# Altium schematic sheet SCH.SchDoc
size A4
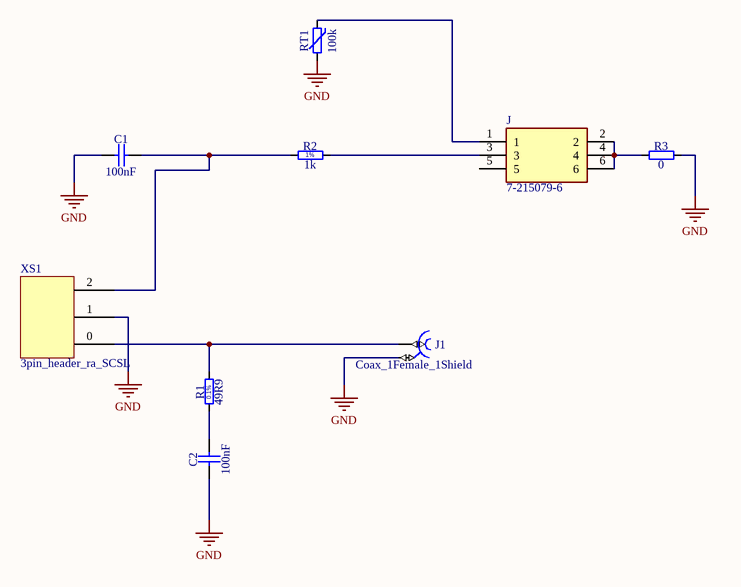
[diagram p0: SCH.SchDoc]

## Parts
C1  100nF  [CAPC2012X135N]
C2  100nF  [CAPC2012X135N]
J  7-215079-6  [TE_7-215079-6]
J1  Coax_1Female_1Shield  [HUBER-SUHNER_85_MMCX-50-0-1/111_OE]
R1  49R9  [RESC2012X60N]
R2  1k  [RESC2012X60N]
R3  0  [RESC2012X60N]
RT1  100k  [THERMC2013X95N]
XS1  3pin_header_ra_SCSL  [3pin_header_SCSL_FEMALE]

## Nets
GND: C1.1 C2.1 J1.2 R3.2 RT1.1 XS1.1
NetC1_2: C1.2 R2.1 XS1.2
NetC2_2: C2.2 R1.1
NetJ1_1: J1.1 R1.2 XS1.0
NetJ_1: J.1 RT1.2
NetJ_2: J.2 J.4 J.6 R3.1
NetJ_3: J.3 R2.2

Not connected (* = marked no-connect by the designer): J 5

## Notes on the sheet
- (in symbol R0805_1K_1%_0.33W_100PPM_VISHAY_CRCW-HP) 1%
- (in symbol R0805_49R9_0.1%_0.1W_10PPM) 0.1%

## Library data of the parts
C1 C2 = CC0805_100NF_50V_10%_X7R: Non-polarised capacitor; Part Description: SMD Multilayer Chip Ceramic Capacitor; Manufacturer: GENERIC; Manufacturer1 Part Number: C2012X7R1H104K085AA; Voltage: 50V; TC: X7R; Tolerance: ±10%; Part Number: CC0805_100NF_50V_10%_X7R; Component Kind: Standard; Component Type: Standard; Pin Count: 2; Value: 100nF; Status: Preferred; Manufacturer Part Number: CC0805_100NF_50V_10%_X7R; Case: 0805; Mounted: Yes; Socket: No; SMD: Yes; Sense: No; Manufacturer1 Example: TDK; Manufacturer1 ComponentHeight: 1mm; HelpURL: \\cern.ch\dfs\Applications\Altium\Datasheets\CC0805_X7R_TDK_C.pdf; Author: CERN DEM JLC; CreateDate: 03.12.2007; LatestRevisionDate: 22.04.2015
J = 7-215079-6: Conn FFC Connector F 6 POS 1.27mm Solder ST Thru-Hole Automotive Box/Carton; MF: TE Connectivity; Price: None; Availability: Unavailable; MP: 7-215079-6; Value: *; SnapEDA_Link: https://www.snapeda.com/parts/7-215079-6/TE%20Connectivity%20AMP%20Connectors/view-part/498770/?ref=snap; Package: None
J1 = HUBER-SUHNER_85_MMCX-50-0-1/111_OE: Part Description: MMCX 50 Ohms Right Angle PCB Jack; Manufacturer: HUBER+SUHNER; PressFit: No; Part Number: HUBER-SUHNER_85_MMCX-50-0-1/111_OE; Component Kind: Standard; Component Type: Standard; Pin Count: 2; Family: MMCX; Mounted: Yes; Socket: No; SMD: No; Sense: No; Status: None; Manufacturer Part Number: 85_MMCX-50-0-1/111_OE; ComponentHeight: 9.6mm; HelpURL: \\cern.ch\dfs\Applications\Altium\Datasheets\HUBER-SUHNER_85_MMCX-50-0-1-111_OE.pdf; Author: CERN DEM JLC; CreateDate: 06.11.2014; LatestRevisionDate: 06.11.2014
R1 = R0805_49R9_0.1%_0.1W_10PPM: Resistor - 0.1%; Part Description: Thin Film Chip Resistor; Manufacturer: GENERIC; Manufacturer1 Part Number: RN73C2A49R9BTG; Power: 0.1W; TC: ±10ppm; PressFit: No; Part Number: R0805_49R9_0.1%_0.1W_10PPM; Component Kind: Standard; Component Type: Standard; Pin Count: 2; Value: 49R9; Status: Not Recommended; Tolerance: ±0.1%; Manufacturer Part Number: R0805_49R9_0.1%_0.1W_10PPM; Case: 0805; Mounted: Yes; Sense: No; Socket: No; SMD: Yes; Manufacturer1 Example: TYCO HOLSWORTHY; Manufacturer1 ComponentHeight: 0.6mm; HelpURL: \\cern.ch\dfs\Applications\Altium\Datasheets\R0805_Tyco_RN73.pdf; Author: CERN DEM JLC; CreateDate: 03.12.2007; LatestRevisionDate: 13.03.2008
R2 = R0805_1K_1%_0.33W_100PPM_VISHAY_CRCW-HP: Resistor - 1%; Part Description: 150V, Pulse Proof, High Power Thick Film Chip Resistor; Manufacturer: VISHAY DRALORIC; Manufacturer Part Number: CRCW08051K00FKEAHP; Power: 0.33W; TC: ±100ppm/°C; PressFit: No; Part Number: R0805_1K_1%_0.33W_100PPM_VISHAY_CRCW-HP; Component Kind: Standard; Component Type: Standard; Pin Count: 2; Value: 1k; Status: None; Tolerance: ±1%; Case: 0805; Mounted: Yes; Sense: No; Socket: No; SMD: Yes; Manufacturer1 ComponentHeight: 0.6mm; HelpURL: \\cern.ch\dfs\Applications\Altium\Datasheets\R0805_VISHAY_CRCW-HP e3.pdf; Author: CERN DEM JLC; CreateDate: 16.06.2010; LatestRevisionDate: 16.06.2010
R3 = R0805_0R_JUMPER: Resistor; Part Description: 2A (0.05R Max DC Resistance) Zero Ohm Jumper; Manufacturer: GENERIC; Manufacturer1 Part Number: NRC10Z0; PressFit: No; Part Number: R0805_0R_JUMPER; Component Kind: Standard; Component Type: Standard; Pin Count: 2; Value: 0; Status: Preferred; Manufacturer Part Number: R0805_0R_JUMPER; Case: 0805; Mounted: Yes; Sense: No; Socket: No; SMD: Yes; Manufacturer1 Example: NIC COMPONENT; Manufacturer1 ComponentHeight: 0.6mm; HelpURL: \\cern.ch\dfs\Applications\Altium\Datasheets\R0805_NIC_NRC.pdf; Author: CERN DEM JLC; CreateDate: 03.12.2007; LatestRevisionDate: 13.03.2008
RT1 = THERM_NTC_68K_VISHAY_NTCS0805E3683FXT: Thermistor NTC (Negative Temperature Coefficient); Part Description: SMD 0805, Glass Protected NTC Thermistors; Manufacturer: VISHAY; Power: 210mW; Tolerance: ±1%; Part Number: THERM_NTC_68K_VISHAY_NTCS0805E3683FXT; Component Kind: Standard; Component Type: Standard; Pin Count: 2; Value: 100k; Status: None; Manufacturer Part Number: NTCS0805E3683FXT; Case: 0805; Mounted: Yes; Socket: No; SMD: Yes; Sense: No; ComponentHeight: 0.95mm; HelpURL: \\cern.ch\dfs\Applications\Altium\Datasheets\THERM_VISHAY_NTCS0805E3683FXT.pdf; Author: CERN DEM JLC; CreateDate: 28.10.2013; LatestRevisionDate: 28.10.2013